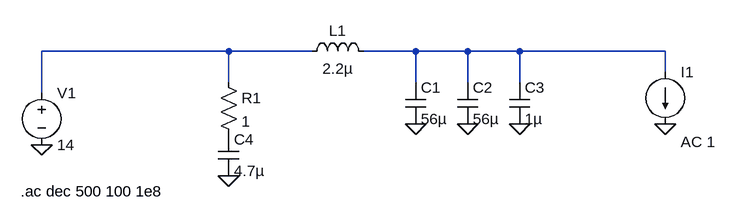
[diagram p0: schematic RegulatorInputFilter.asc]
RegulatorInputFilter.asc, the LTspice schematic file:
Version 4
SHEET 1 880 680
WIRE 16 80 -272 80
WIRE 144 80 16 80
WIRE 304 80 224 80
WIRE 384 80 304 80
WIRE 464 80 384 80
WIRE 688 80 464 80
WIRE 688 112 688 80
WIRE 16 128 16 80
WIRE 304 128 304 80
WIRE 384 128 384 80
WIRE 464 128 464 80
WIRE -272 144 -272 80
FLAG 304 192 0
FLAG 384 192 0
FLAG 464 192 0
FLAG 16 272 0
FLAG 688 192 0
FLAG -272 224 0
SYMBOL ind 128 96 R270
WINDOW 0 32 56 VTop 2
WINDOW 3 5 56 VBottom 2
SYMATTR InstName L1
SYMATTR Value 2.2µ
SYMATTR SpiceLine Rser=1
SYMBOL cap 288 128 R0
SYMATTR InstName C1
SYMATTR Value 56µ
SYMATTR SpiceLine Rser=35m
SYMBOL cap 368 128 R0
SYMATTR InstName C2
SYMATTR Value 56µ
SYMATTR SpiceLine Rser=35m
SYMBOL cap 448 128 R0
SYMATTR InstName C3
SYMATTR Value 1µ
SYMATTR SpiceLine Rser=1m
SYMBOL res 0 112 R0
SYMATTR InstName R1
SYMATTR Value 1
SYMBOL cap 0 208 R0
SYMATTR InstName C4
SYMATTR Value 4.7µ
SYMBOL current 688 112 R0
WINDOW 123 24 108 Left 2
WINDOW 39 0 0 Left 0
SYMATTR Value2 AC 1
SYMATTR InstName I1
SYMATTR Value ""
SYMBOL voltage -272 128 R0
WINDOW 123 0 0 Left 0
WINDOW 39 0 0 Left 0
SYMATTR InstName V1
SYMATTR Value 14
TEXT -304 296 Left 2 !.ac dec 500 100 1e8

The netlist it stands for:
* RegulatorInputFilter.asc
L1 N001 N002 2.2µ Rser=1
C1 N002 0 56µ Rser=35m
C2 N002 0 56µ Rser=35m
C3 N002 0 1µ Rser=1m
R1 N001 P001 1
C4 P001 0 4.7µ
I1 N002 0 AC 1
V1 N001 0 14
.ac dec 500 100 1e8
.backanno
.end